# EAGLE schematic MOSFET_H-Bridge (EAGLE 7.1.0)
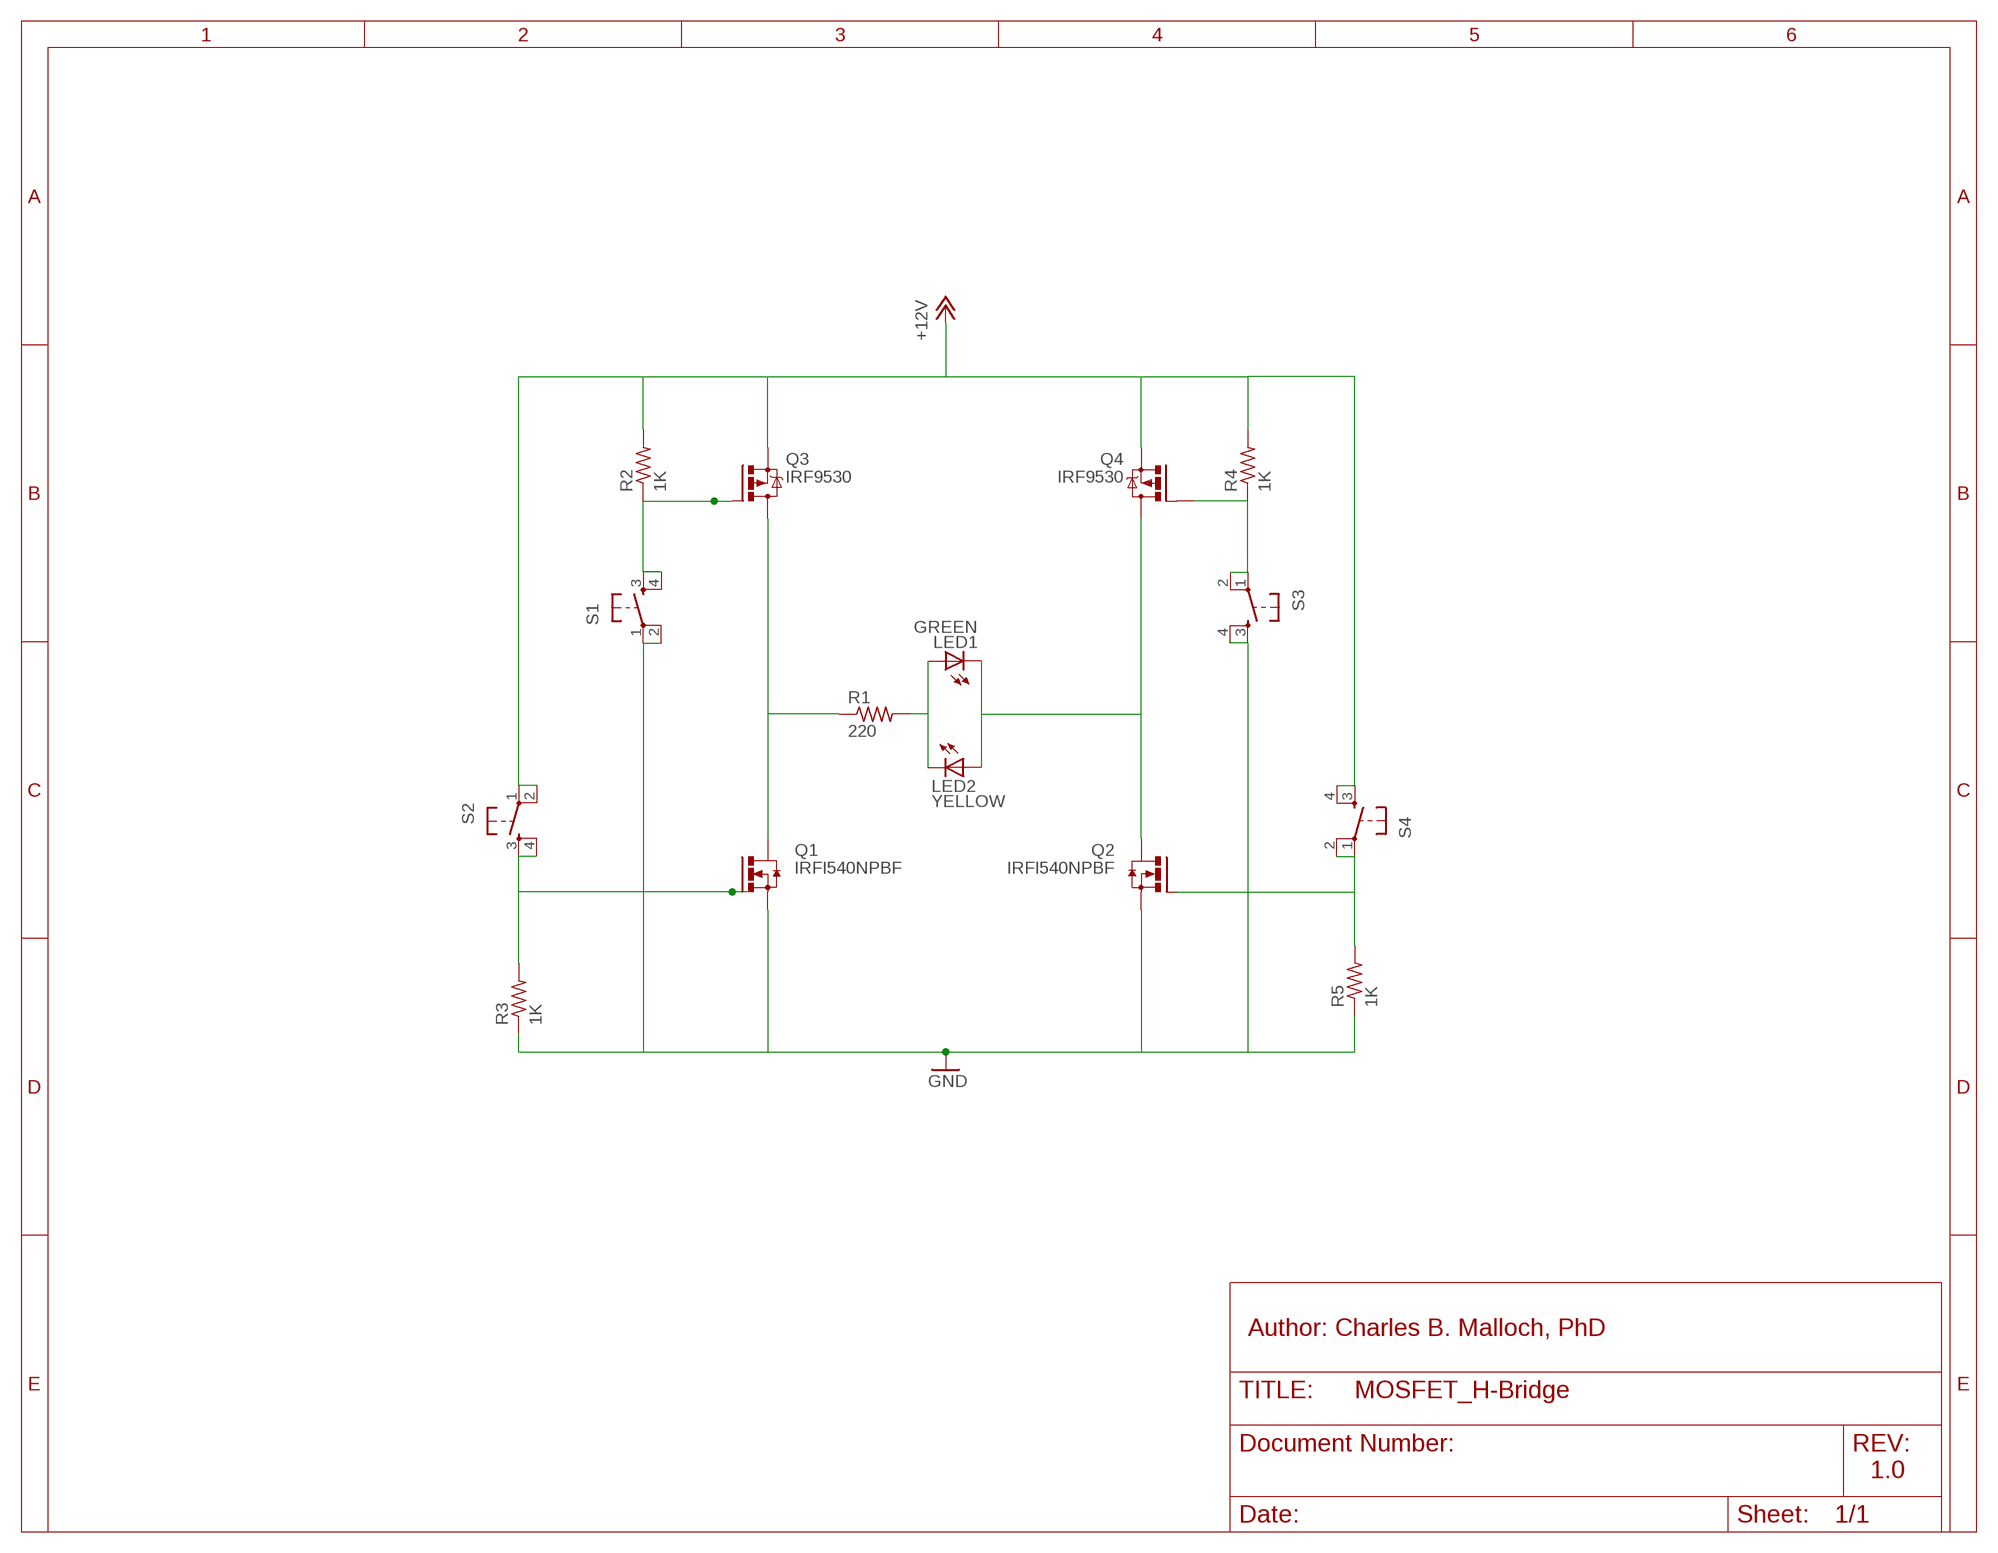
[diagram p0: schematic, sheet 1]

## Parts
LED1  GREEN  LEDLUMILED  [LUMILED]
LED2  YELLOW  LEDLUMILED  [LUMILED]
Q1  IRFI540NPBF  [TO220BH]
Q2  IRFI540NPBF  [TO220BH]
Q3  IRF9530  [TO220BV]
Q4  IRF9530  [TO220BV]
R1  220  R-US_0207/10  [0207/10]
R2  1K  R-US_0207/10  [0207/10]
R3  1K  R-US_0207/10  [0207/10]
R4  1K  R-US_0207/10  [0207/10]
R5  1K  R-US_0207/10  [0207/10]
S1  TAC_SWITCHPTH  [TACTILE-PTH]
S2  TAC_SWITCHPTH  [TACTILE-PTH]
S3  TAC_SWITCHPTH  [TACTILE-PTH]
S4  TAC_SWITCHPTH  [TACTILE-PTH]

## Nets
+12V: Q3.S Q4.S R2.2 R4.2 S4.3 S4.4
GND: Q1.S Q2.S R3.1 R5.1 S1.1 S1.2 S3.3 S3.4
N$1: Q3.G R2.1 S1.3 S1.4
N$3: Q4.G R4.1 S3.1 S3.2
N$4: LED1.4-(C) LED2.2+(A) Q2.D Q4.D
N$5: LED1.2+(A) LED2.4-(C) R1.2
N$6: Q1.D Q3.D R1.1
N$7: Q2.G R5.2 S4.1 S4.2
N$8: S2.1 S2.2
N$10: Q1.G R3.2 S2.3 S2.4

## Notes on the sheet
- Author: Charles B. Malloch, PhD
- 1.0

## Library data of the parts
LED1 LED2 = led-lumiled:LED: LED - LUMILED® LXK2-PW12-R00, LXK2-PW12-S00, LXK2-PW14-U00, LXK2-PW14-V00 LXK2-PM12-R00, LXK2-PM12-S00, LXK2-PM14-U00 LXK2-PE12-Q00, LXK2-PE12-R00, LXK2-PE12-S00, LXK2-PE14-T00, LXK2-PE14-U00 LXK2-PB12-K00, LXK2-PB12-L00, LXK2-PB12-M00, LXK2-PB14-N00, LXK2-PB14-P00, LXK2-PB14-Q00 LXK2-PR12-L00, LXK2-PR12-M00, LXK2-PR14-Q00, LXK2-PR14-R00 LXK2-PD12-Q00, LXK2-PD12-R00, LXK2-PD12-S00 LXK2-PH12-R00, LXK2-PH12-S00 LXK2-PL12-P00, LXK2-PL12-Q00, LXK2-PL12-R00 Source: www.luxeon.com; OC_FARNELL: unknown; OC_NEWARK: unknown
Q1 Q2 = transistor-power:IRFI540NPBF: HEXFET Power MOISFET VDSS = 100V, RDS(on) = 0.052 Ohm, ID = 20A, VGS(th) = 2.0 -- 4.0V Source: http://www.irf.com/product-info/datasheets/data/irfi540npbf.pdf
Q3 Q4 = transistor-power:IRF9530: P-CHANNEL HEXFET POWER-MOS-FET Source: http://www.irf.com/product-info/datasheets/data/irf9530.pdf
R1-R5 = resistor:R-US_: RESISTOR, American symbol
S1-S4 = SparkFun-Electromechanical:TAC_SWITCH: Momentary Switch Button commonly used for reset or general input. Spark Fun Electronics SKU : COM-00097 SMT- SWCH-08247